# Altium schematic sheet 数字部分.SchDoc
size A2
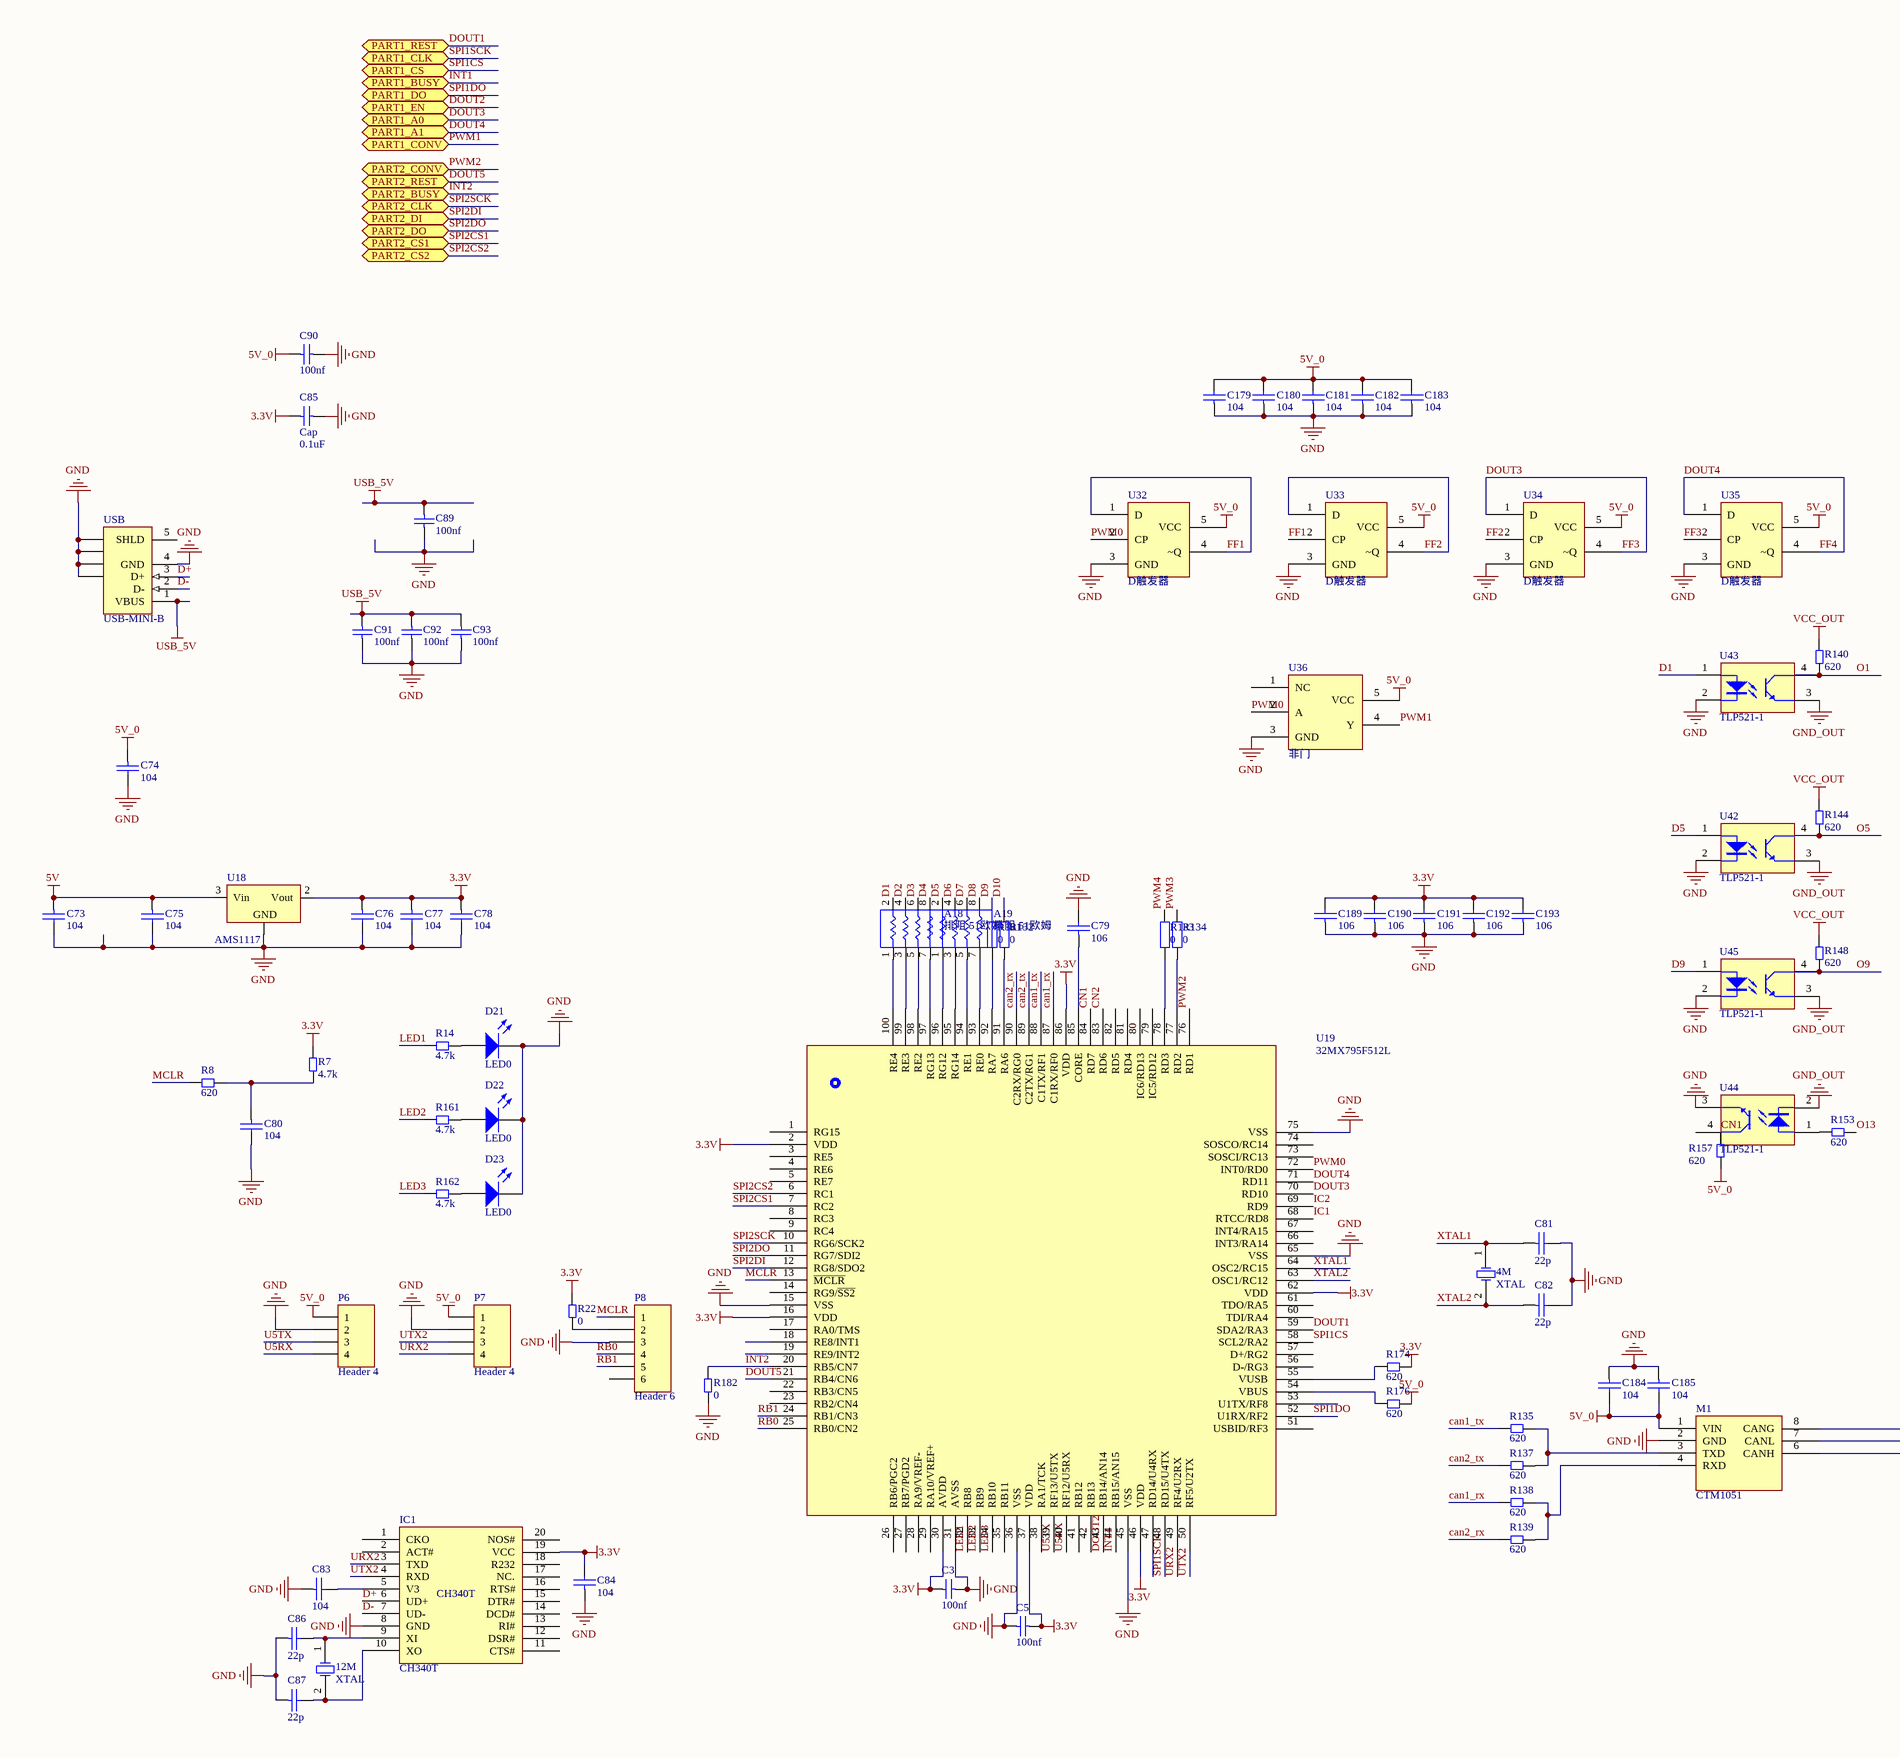
[diagram p0: 数字部分.SchDoc, left]
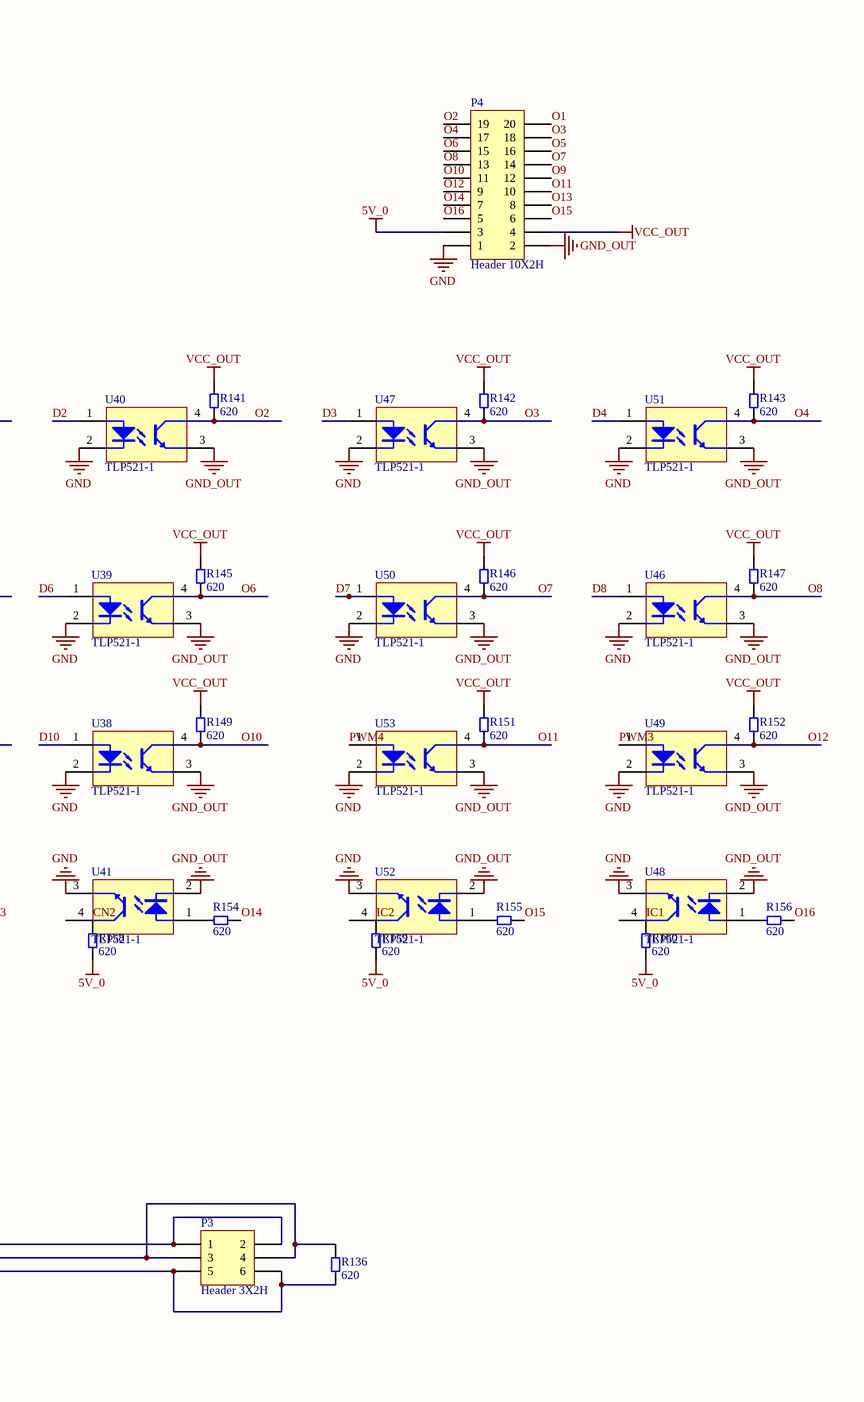
[diagram p1: 数字部分.SchDoc, right]

## Parts
4M  XTAL  [5032-xtal]
12M  XTAL  [5032-xtal]
A18  排阻 51欧姆  [RCA03-4D]
A19  排阻 51欧姆  [RCA03-4D]
C3  value 100nf  [0805C]  (hidden comment: Cap)
C5  value 100nf  [0805C]  (hidden comment: Cap)
C73  104  [0805C]
C74  104  [0805C]
C75  104  [0805C]
C76  104  [0805C]
C77  104  [0805C]
C78  104  [0805C]
C79  106  [0805C]
C80  104  [0805C]
C81  22p  [0805C]
C82  22p  [0805C]
C83  104  [0805C]
C84  104  [0805C]
C85  Cap  value 0.1uF  [0805C]
C86  22p  [0805C]
C87  22p  [0805C]
C89  value 100nf  [1812-C]  (hidden comment: Cap)
C90  value 100nf  [0805C]  (hidden comment: Cap)
C91  value 100nf  [0805C]  (hidden comment: Cap)
C92  value 100nf  [0805C]  (hidden comment: Cap)
C93  value 100nf  [0805C]  (hidden comment: Cap)
C179  104  [0805C]
C180  104  [0805C]
C181  104  [0805C]
C182  104  [0805C]
C183  104  [0805C]
C184  104  [0805C]
C185  104  [0805C]
C189  106  [0805C]
C190  106  [0805C]
C191  106  [0805C]
C192  106  [0805C]
C193  106  [0805C]
D21  LED0  [0805C]
D22  LED0  [0805C]
D23  LED0  [0805C]
IC1  CH340T  [TSSOP20]
M1  CTM1051  [CTM1051]
P3  Header 3X2H  [3.81MM-3P*2]
P4  Header 10X2H  [20P牛角]
P6  Header 4  [PH2.0 D-L-4P]
P7  Header 4  [PH2.0 D-L-4P]
P8  Header 6  [PH2.0 D-L-6P]
R7  4.7k  [0805R]
R8  620  [0805R]
R14  4.7k  [0805R]
R22  0  [0805R]
R131  value 0  [0603AR]  (hidden comment: Res2)
R132  value 0  [0603AR]  (hidden comment: Res2)
R133  value 0  [0603AR]  (hidden comment: Res2)
R134  value 0  [0603AR]  (hidden comment: Res2)
R135  620  [0805R]
R136  620  [FB1206]
R137  620  [0805R]
R138  620  [0805R]
R139  620  [0805R]
R140  620  [0805R]
R141  620  [0805R]
R142  620  [0805R]
R143  620  [0805R]
R144  620  [0805R]
R145  620  [0805R]
R146  620  [0805R]
R147  620  [0805R]
R148  620  [0805R]
R149  620  [0805R]
R151  620  [0805R]
R152  620  [0805R]
R153  620  [0805R]
R154  620  [0805R]
R155  620  [0805R]
R156  620  [0805R]
R157  620  [0805R]
R158  620  [0805R]
R159  620  [0805R]
R160  620  [0805R]
R161  4.7k  [0805R]
R162  4.7k  [0805R]
R174  620  [0805R]
R176  620  [0805R]
R182  0  [0805R]
U18  AMS1117  [_SOT-223]
U19  32MX795F512L  [TQFP100]
U32  D触发器  [SOT-23-5]
U33  D触发器  [SOT-23-5]
U34  D触发器  [SOT-23-5]
U35  D触发器  [SOT-23-5]
U36  非门  [SOT-23-5]
U38  TLP521-1  [SOP4]
U39  TLP521-1  [SOP4]
U40  TLP521-1  [SOP4]
U41  TLP521-1  [SOP4]
U42  TLP521-1  [SOP4]
U43  TLP521-1  [SOP4]
U44  TLP521-1  [SOP4]
U45  TLP521-1  [SOP4]
U46  TLP521-1  [SOP4]
U47  TLP521-1  [SOP4]
U48  TLP521-1  [SOP4]
U49  TLP521-1  [SOP4]
U50  TLP521-1  [SOP4]
U51  TLP521-1  [SOP4]
U52  TLP521-1  [SOP4]
U53  TLP521-1  [SOP4]
USB  USB-MINI-B  [USB-MINI-B - 引脚加长]

## Ports
PART1_A0, PART1_A1, PART1_BUSY, PART1_CLK, PART1_CONV, PART1_CS, PART1_DO, PART1_EN, PART1_REST, PART2_BUSY, PART2_CLK, PART2_CONV, PART2_CS1, PART2_CS2, PART2_DI, PART2_DO, PART2_REST

## Nets
3.3V: C3.2 C5.2 C76.1 C77.1 C78.1 C84.2 C85.2 C189.2 C190.2 C191.2 C192.2 C193.2 IC1.19(VCC) R7.1 R22.2 R174.2 U18.2(Vout) U19.2(VDD) U19.16(VDD) U19.30(AVDD) U19.37(VDD) U19.46(VDD) U19.62(VDD) U19.86(VDD)
5V: C73.1 C75.1 U18.3(Vin)
5V_0: C74.1 C90.2 C179.2 C180.2 C181.2 C182.2 C183.2 C184.2 C185.2 M1.1(VIN) P4.3 P6.1 P7.1 R157.2 R158.2 R159.2 R160.2 R176.2 U32.5(VCC) U33.5(VCC) U34.5(VCC) U35.5(VCC) U36.5(VCC)
GND: C3.1 C5.1 C73.2 C74.2 C75.2 C76.2 C77.2 C78.2 C79.2 C80.2 C81.2 C82.2 C83.1 C84.1 C85.1 C86.1 C87.1 C89.1 C90.1 C91.1 C92.1 C93.1 C179.1 C180.1 C181.1 C182.1 C183.1 C184.1 C185.1 C189.1 C190.1 C191.1 C192.1 C193.1 D21.2(K) D22.2(K) D23.2(K) IC1.8(GND) M1.2(GND) P4.1 P6.2 P7.2 P8.3 R182.1 U18.1(GND) U19.15(VSS) U19.31(AVSS) U19.36(VSS) U19.45(VSS) U19.65(VSS) U19.75(VSS) U32.3(GND) U33.3(GND) U34.3(GND) U35.3(GND) U36.3(GND) U38.2 U39.2 U40.2 U41.3 U42.2 U43.2 U44.3 U45.2 U46.2 U47.2 U48.3 U49.2 U50.2 U51.2 U52.3 U53.2 USB.4(GND) USB.6(SHLD) USB.7(SHLD) USB.8(SHLD) USB.9(SHLD)
GND_OUT: P4.2 U38.3 U39.3 U40.3 U41.2 U42.3 U43.3 U44.2 U45.3 U46.3 U47.3 U48.2 U49.3 U50.3 U51.3 U52.2 U53.3
USB_5V: C89.2 C91.2 C92.2 C93.2 USB.1(VBUS)
VCC_OUT: P4.4 R140.2 R141.2 R142.2 R143.2 R144.2 R145.2 R146.2 R147.2 R148.2 R149.2 R151.2 R152.2
can1_rx: R138.1 U19.87(C1RX/RF0)
can1_tx: R135.1 U19.88(C1TX/RF1)
can2_rx: R139.1 U19.90(C2RX/RG0)
can2_tx: R137.1 U19.89(C2TX/RG1)
CN1: R157.1 U19.84(RD7) U44.4
CN2: R158.1 U19.83(RD6) U41.4
D1: A18.2 U43.1
D2: A18.4 U40.1
D3: A18.6 U47.1
D4: A18.8 U51.1
D5: A19.2 U42.1
D6: A19.4 U39.1
D7: A19.6 U50.1
D8: A19.8 U46.1
D9: R131.1 U45.1
D10: R132.1 U38.1
D+: IC1.6(UD+) USB.3(D+)
D-: IC1.7(UD-) USB.2(D-)
DOUT1: U19.59(SDA2/RA3) ; port PART1_REST
DOUT2: U19.43(RB14/AN14) ; port PART1_EN
DOUT3: U19.70(RD10) U34.1(D) U34.4(~Q) U35.2(CP) ; port PART1_A0  [also labelled FF3]
DOUT4: U19.71(RD11) U35.1(D) U35.4(~Q) ; port PART1_A1  [also labelled FF4]
DOUT5: U19.21(RB4/CN6) ; port PART2_REST
FF1: U32.1(D) U32.4(~Q) U33.2(CP)
FF2: U33.1(D) U33.4(~Q) U34.2(CP)
IC1: R160.1 U19.68(RTCC/RD8) U48.4
IC2: R159.1 U19.69(RD9) U52.4
INT1: U19.44(RB15/AN15) ; port PART1_BUSY
INT2: R182.2 U19.20(RB5/CN7) ; port PART2_BUSY
LED1: R14.1 U19.32(RB8)
LED2: R161.1 U19.33(RB9)
LED3: R162.1 U19.34(RB10)
MCLR: P8.1 R8.1 U19.13(~{MCLR})
O1: P4.20 R140.1 U43.4
O2: P4.19 R141.1 U40.4
O3: P4.18 R142.1 U47.4
O4: P4.17 R143.1 U51.4
O5: P4.16 R144.1 U42.4
O6: P4.15 R145.1 U39.4
O7: P4.14 R146.1 U50.4
O8: P4.13 R147.1 U46.4
O9: P4.12 R148.1 U45.4
O10: P4.11 R149.1 U38.4
O11: P4.10 R151.1 U53.4
O12: P4.9 R152.1 U49.4
O13: P4.8 R153.2
O14: P4.7 R154.2
O15: P4.6 R155.2
O16: P4.5 R156.2
PWM0: U19.72(INT0/RD0) U32.2(CP) U36.2(A)
PWM1: U36.4(Y) ; port PART1_CONV
PWM2: U19.76(RD1) ; port PART2_CONV
PWM3: R134.1 U49.1
PWM4: R133.1 U53.1
RB0: P8.4 U19.25(RB0/CN2)
RB1: P8.5 U19.24(RB1/CN3)
SPI1CS: U19.58(SCL2/RA2) ; port PART1_CS
SPI1DO: U19.52(U1RX/RF2) ; port PART1_DO
SPI1SCK: U19.48(RD15/U4TX) ; port PART1_CLK
SPI2CS1: U19.7(RC2) ; port PART2_CS1
SPI2CS2: U19.6(RC1) ; port PART2_CS2
SPI2DI: U19.12(RG8/SDO2) ; port PART2_DI
SPI2DO: U19.11(RG7/SDI2) ; port PART2_DO
SPI2SCK: U19.10(RG6/SCK2) ; port PART2_CLK
U5RX: P6.4 U19.40(RF12/U5RX)
U5TX: P6.3 U19.39(RF13/U5TX)
URX2: IC1.3(TXD) P7.4 U19.49(RF4/U2RX)
UTX2: IC1.4(RXD) P7.3 U19.50(RF5/U2TX)
XTAL1: 4M.1(OSC1) C81.1 U19.64(OSC2/RC15)
XTAL2: 4M.2(OSC2) C82.1 U19.63(OSC1/RC12)
Net12M_1: 12M.1(OSC1) C86.2 IC1.9(XI)
Net12M_2: 12M.2(OSC2) C87.2 IC1.10(XO)
NetA18_1: A18.1 U19.100(RE4)
NetA18_3: A18.3 U19.99(RE3)
NetA18_5: A18.5 U19.98(RE2)
NetA18_7: A18.7 U19.97(RG13)
NetA19_1: A19.1 U19.96(RG12)
NetA19_3: A19.3 U19.95(RG14)
NetA19_5: A19.5 U19.94(RE1)
NetA19_7: A19.7 U19.93(RE0)
NetC79_1: C79.1 U19.85(CORE)
NetC80_1: C80.1 R7.2 R8.2
NetC83_2: C83.2 IC1.5(V3)
NetD21_1: D21.1(A) R14.2
NetD22_1: D22.1(A) R161.2
NetD23_1: D23.1(A) R162.2
NetM1_3: M1.3(TXD) R135.2 R137.2
NetM1_4: M1.4(RXD) R138.2 R139.2
NetM1_6: M1.6(CANH) P3.5 P3.6 R136.1
NetM1_7: M1.7(CANL) P3.3 P3.4 R136.2
NetM1_8: M1.8(CANG) P3.1 P3.2
NetP8_2: P8.2 R22.1
NetR131_2: R131.2 U19.92(RA7)
NetR132_2: R132.2 U19.91(RA6)
NetR133_2: R133.2 U19.78(RD3)
NetR134_2: R134.2 U19.77(RD2)
NetR153_1: R153.1 U44.1
NetR154_1: R154.1 U41.1
NetR155_1: R155.1 U52.1
NetR156_1: R156.1 U48.1
NetR174_1: R174.1 U19.55(VUSB)
NetR176_1: R176.1 U19.54(VBUS)

Not connected (* = marked no-connect by the designer): IC1 1(CKO) 2(ACT#) 11(CTS#) 12(DSR#) 13(RI#) 14(DCD#) 15(DTR#) 16(RTS#) 17(NC.) 18(R232) 20(NOS#); P8 6; U19 1(RG15) 3(RE5) 4(RE6) 5(RE7) 8(RC3) 9(RC4) 14(RG9/~{SS2}) 17(RA0/TMS) 18(RE8/INT1) 19(RE9/INT2) 22(RB3/CN5) 23(RB2/CN4) 26(RB6/PGC2) 27(RB7/PGD2) 28(RA9/VREF-) 29(RA10/VREF+) 35(RB11) 38(RA1/TCK) 41(RB12) 42(RB13) 47(RD14/U4RX) 51(USBID/RF3) 53(U1TX/RF8) 56(D-/RG3) 57(D+/RG2) 60(TDI/RA4) 61(TDO/RA5) 66(INT3/RA14) 67(INT4/RA15) 73(SOSCI/RC13) 74(SOSCO/RC14) 79(IC5/RD12) 80(IC6/RD13) 81(RD4) 82(RD5); U36 1(NC); USB 5(SHLD)

## Library data of the parts
4M 12M = XTAL: Crystal Oscillator; Published: 8-Jun-2000; LatestRevisionDate: 17-Jul-2002; LatestRevisionNote: Re-released for DXP Platform.; PackageReference: R38; Publisher: Altium Limited
A18 A19 = RESPACK5
C3 C5 C89-C93 = Cap: Capacitor; Published: 8-Jun-2000; LatestRevisionDate: 17-Jul-2002; LatestRevisionNote: Re-released for DXP Platform.; PackageReference: RAD-0.3; Publisher: Altium Limited; PackageDescription: Radial Cap, Thru-Hole; 2 Leads; 0.3 in Pin Spacing
C73-C84 C86 C87 C179-C185 C189-C193 = CAP: Capacitor
C85 = Cap Semi: Capacitor (Semiconductor SIM Model); Published: 8-Jun-2000; LatestRevisionDate: 29-May-2009; LatestRevisionNote: IPC-7351 Footprint Added.; PackageReference: C1206; Publisher: Altium Limited; PackageDescription: Chip Capacitor
D21-D23 = LED0: Typical INFRARED GaAs LED; Published: 8-Jun-2000; LatestRevisionDate: 08-Jul-2005; LatestRevisionNote: Mech Layer 1 removed.; PackageReference: LED-0; Publisher: Altium Limited; PackageDescription: LED; 2 Leads
P3 = Header 3X2H: Header, 3-Pin, Dual row, Right Angle; LatestRevisionDate: 17-Jul-2002; LatestRevisionNote: Re-released for DXP Platform.; Publisher: Altium Limited
P4 = Header 10X2H: Header, 10-Pin, Dual row, Right Angle; LatestRevisionDate: 17-Jul-2002; LatestRevisionNote: Re-released for DXP Platform.; Publisher: Altium Limited
P6 P7 = Header 4: Header, 4-Pin; LatestRevisionDate: 17-Jul-2002; LatestRevisionNote: Re-released for DXP Platform.; Publisher: Altium Limited
P8 = Header 6: Header, 6-Pin; LatestRevisionDate: 17-Jul-2002; LatestRevisionNote: Re-released for DXP Platform.; Publisher: Altium Limited
R7 R8 R14 R22 R135-R149 R151-R162 R174 R176 R182 = RES2
R131-R134 = Res2: Resistor; Published: 8-Jun-2000; LatestRevisionDate: 17-Jul-2002; LatestRevisionNote: Re-released for DXP Platform.; PackageReference: AXIAL-0.4; Publisher: Altium Limited; PackageDescription: Axial Device, Thru-Hole; 2 Leads; 0.4 in Pin Spacing
U18 = AMS1117: LDO
U38-U53 = TLP521-1: 光耦
USB = USB-MINI-B: USB 2.0, Right Angle, SMT, A Type, Receptacle, 5 Position, Black; ContactMaterial: Phosphor Bronze; ContactPlating: Gold (30) over Nickel; PCB_Layout: Complies with manufacturer's recommendation.; DrillSize: Corresponds to nominal value.; PanelGround: Without; Published: 15-Jul-2004; DatasheetDocument: 15-Nov-2002; PackageDocument: 15-Nov-2002; PackageReference: 440478; Publisher: Altium Limited; HousingMaterial: Thermoplastic; ComponentLink1Description: Manufacturer Link; ComponentLink1URL: http://www.tycoelectronics.com/; ComponentLink2Description: Packaging Specification; ComponentLink2URL: http://ecommas.tycoelectronics.com/commerce/DocumentDelivery/DDEController?Action=showdoc&DocId=Customer+Drawing%7F440478%7FB%7Fpdf%7FEnglish%7FC_440478_B.pdf